# Altium schematic sheet SCH_RP2040_2022-08-20.schdoc
size 298 x 162 mm
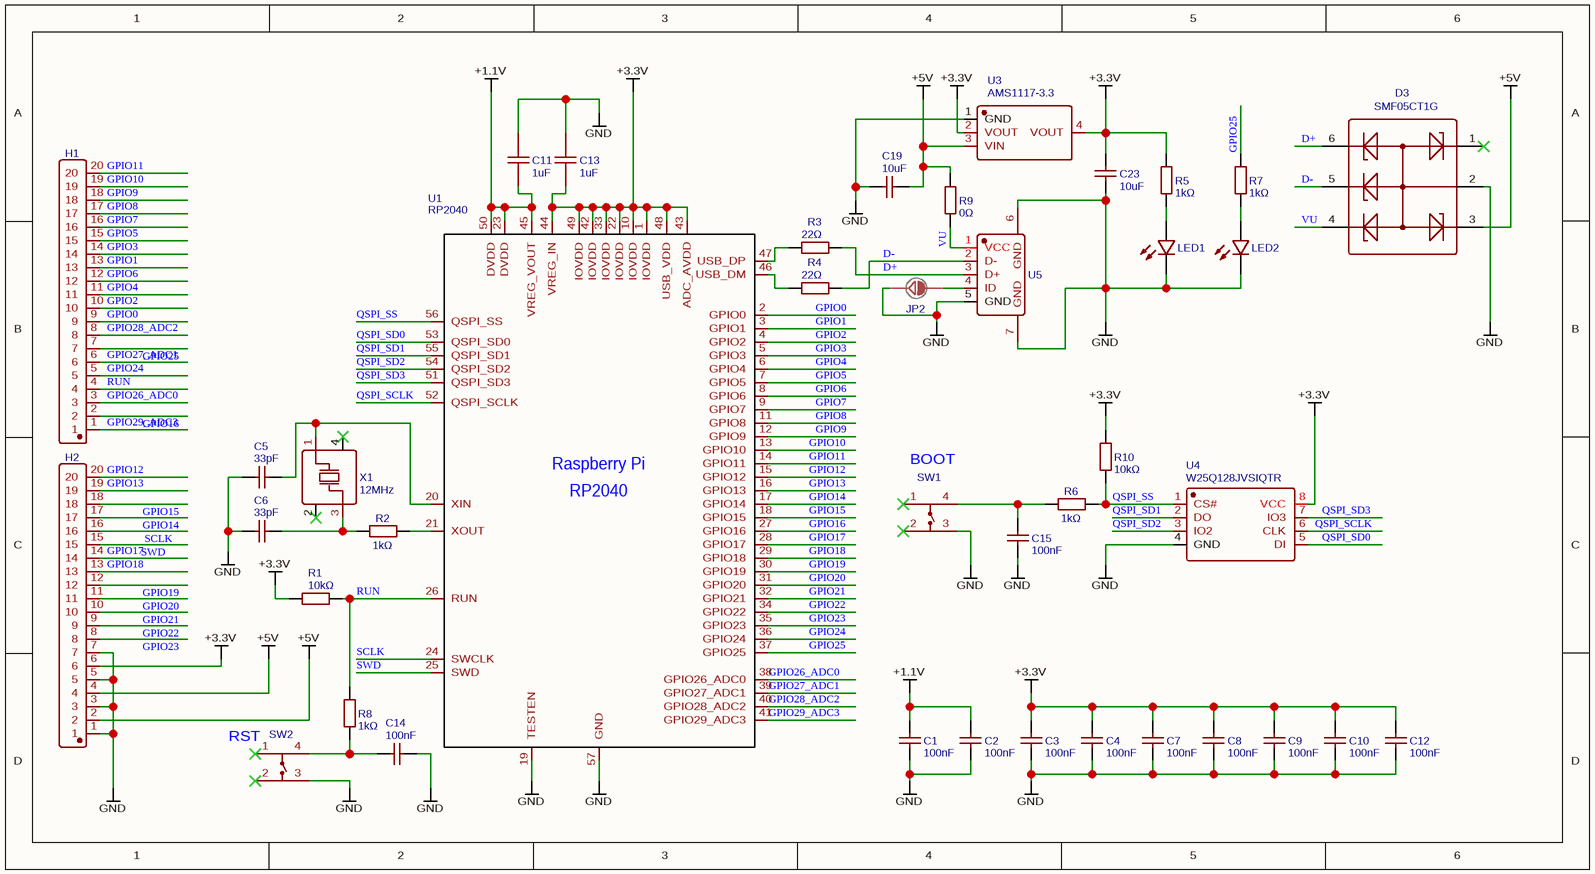
[diagram p0: SCH_RP2040_2022-08-20.schdoc]

## Parts
C1  100nF  [C0402_NEW]
C2  100nF  [C0402_NEW]
C3  100nF  [C0402_NEW]
C4  100nF  [C0402_NEW]
C5  33pF  [C0402]
C6  33pF  [C0402]
C7  100nF  [C0402_NEW]
C8  100nF  [C0402_NEW]
C9  100nF  [C0402_NEW]
C10  100nF  [C0402_NEW]
C11  1uF  [C0402]
C12  100nF  [C0402_NEW]
C13  1uF  [C0402]
C14  100nF  [C0402_NEW]
C15  100nF  [C0402_NEW]
C19  10uF  [C1206]
C23  10uF  [C1206]
D3  SMF05CT1G  [SOT-363_L2.0-W1.3-P0.65-LS2.1-TL]
H1  KH-2.54PH180-1X20P-L11.5  [HDR-TH_20P-P2.54-V-M]  (value not drawn)
H2  KH-2.54PH180-1X20P-L11.5  [HDR-TH_20P-P2.54-V-M]  (value not drawn)
JP2  JUMPER-SMT_2  [JUMPERS_SMT-JUMPER_2_NC_PASTE_NO-SILK]  (value not drawn)
LED1  19-217/BHC-ZL1M2RY/3T  [LED0603-R-RD_BLUE]  (value not drawn)
LED2  19-217/BHC-ZL1M2RY/3T  [LED0603-R-RD_BLUE]  (value not drawn)
R1  10kΩ  [R0402]
R2  1kΩ  [R0402]
R3  22Ω  [R0402]
R4  22Ω  [R0402]
R5  1kΩ  [R0402]
R6  1kΩ  [R0402]
R7  1kΩ  [R0402]
R8  1kΩ  [R0402]
R9  0Ω  [R0603]
R10  10kΩ  [R0402]
SW1  TD-1182SA-2.0H-250  [SW-SMD_4P-L3.5-W3.0-P1.50-LS4.6_DEALON_TD-1182SA-2.0H-250]  (value not drawn)
SW2  TD-1182SA-2.0H-250  [SW-SMD_4P-L3.5-W3.0-P1.50-LS4.6_DEALON_TD-1182SA-2.0H-250]  (value not drawn)
U1  RP2040  [LQFN-56_L7.0-W7.0-P0.4-EP]
U3  AMS1117-3.3  [SOT-223-3_L6.5-W3.4-P2.30-LS7.0-BR]
U4  W25Q128JVSIQTR  [SOIC-8_L5.3-W5.3-P1.27-LS8.0-BL]
U5  U253-051N-4BH89-S2S  [MICRO-USB-SMD_U253-051N-4BH89-S2S]  (value not drawn)
X1  12MHz  [OSC-SMD_4P-L3.2-W2.5-BL]

## Nets
+1.1V: C1.2 C2.2 C11.1 U1.23(DVDD) U1.45(VREG_VOUT) U1.50(DVDD)
+3.3V: C3.2 C4.2 C7.2 C8.2 C9.2 C10.2 C12.2 C13.1 C23.2 H2.6 R1.2 R5.2 R10.2 U1.1(IOVDD) U1.10(IOVDD) U1.22(IOVDD) U1.33(IOVDD) U1.42(IOVDD) U1.43(ADC_AVDD) U1.44(VREG_IN) U1.48(USB_VDD) U1.49(IOVDD) U3.2(VOUT) U3.4(VOUT) U4.8(VCC)
+5V: C19.2 D3.3 H2.2 H2.4 R9.2 U3.3(VIN)
GND: C1.1 C2.1 C3.1 C4.1 C5.1 C6.1 C7.1 C8.1 C9.1 C10.1 C11.2 C12.1 C13.2 C14.1 C15.1 C19.1 C23.1 D3.2 H2.1 H2.3 H2.5 H2.7 JP2.1 LED1.2(C) LED2.2(C) SW1.3 SW2.3 U1.19(TESTEN) U1.57(GND) U3.1(GND) U4.4(GND) U5.5(GND) U5.6(GND) U5.7(GND)
D+: D3.6 R3.1 U5.3(D+)
D-: D3.5 R4.1 U5.2(D-)
GPIO0: H1.9 U1.2(GPIO0)
GPIO1: H1.13 U1.3(GPIO1)
GPIO2: H1.10 U1.4(GPIO2)
GPIO3: H1.14 U1.5(GPIO3)
GPIO4: H1.11 U1.6(GPIO4)
GPIO5: H1.15 U1.7(GPIO5)
GPIO6: H1.12 U1.8(GPIO6)
GPIO7: H1.16 U1.9(GPIO7)
GPIO8: H1.17 U1.11(GPIO8)
GPIO9: H1.18 U1.12(GPIO9)
GPIO10: H1.19 U1.13(GPIO10)
GPIO11: H1.20 U1.14(GPIO11)
GPIO12: H2.20 U1.15(GPIO12)
GPIO13: H2.19 U1.16(GPIO13)
GPIO14: H2.17 U1.17(GPIO14)
GPIO15: H2.18 U1.18(GPIO15)
GPIO16: H1.2 U1.27(GPIO16)
GPIO17: H2.14 U1.28(GPIO17)
GPIO18: H2.13 U1.29(GPIO18)
GPIO19: H2.12 U1.30(GPIO19)
GPIO20: H2.11 U1.31(GPIO20)
GPIO21: H2.10 U1.32(GPIO21)
GPIO22: H2.9 U1.34(GPIO22)
GPIO23: H2.8 U1.35(GPIO23)
GPIO24: H1.5 U1.36(GPIO24)
GPIO25: H1.7 R7.2 U1.37(GPIO25)
GPIO26_ADC0: H1.3 U1.38(GPIO26_ADC0)
GPIO27_ADC1: H1.6 U1.39(GPIO27_ADC1)
GPIO28_ADC2: H1.8 U1.40(GPIO28_ADC2)
GPIO29_ADC3: H1.1 U1.41(GPIO29_ADC3)
QSPI_SCLK: U1.52(QSPI_SCLK) U4.6(CLK)
QSPI_SD0: U1.53(QSPI_SD0) U4.5(DI)
QSPI_SD1: U1.55(QSPI_SD1) U4.2(DO)
QSPI_SD2: U1.54(QSPI_SD2) U4.3(IO2)
QSPI_SD3: U1.51(QSPI_SD3) U4.7(IO3)
QSPI_SS: R6.2 R10.1 U1.56(QSPI_SS) U4.1(CS#)
RUN: H1.4 R1.1 R8.2 U1.26(RUN)
SCLK: H2.16 U1.24(SWCLK)
SWD: H2.15 U1.25(SWD)
VU: D3.4 R9.1 U5.1(VCC)
NetC5_2: C5.2 U1.20(XIN) X1.1(OSC1)
NetC6_2: C6.2 R2.1 X1.3(OSC2)
NetC14_2: C14.2 R8.1 SW2.4
NetC15_2: C15.2 R6.1 SW1.4
NetJP2_2: JP2.2 U5.4(ID)
NetLED1_1: LED1.1(A) R5.1
NetLED2_1: LED2.1(A) R7.1
NetR2_2: R2.2 U1.21(XOUT)
NetR3_2: R3.2 U1.47(USB_DP)
NetR4_2: R4.2 U1.46(USB_DM)

Not connected (* = marked no-connect by the designer): D3 1*; SW1 1* 2*; SW2 1* 2*; X1 2(GND)* 4(GND)*

## Notes on the sheet
- (near SW1) BOOT
- (near SW2) RST
- (in symbol RP2040) Raspberry Pi

## Library data of the parts
C1-C4 C7-C10 C12 C14 C15 = 100nF: BOM_Manufacturer Part: CL05B104KO5NNNC; BOM_Manufacturer: SAMSUNG; nameAlias: Capacitance; BOM_Supplier: LCSC; BOM_Supplier Part: C1525; BOM_JLCPCB Part Class: Basic Part; spicePre: C; spiceSymbolName: CL05B104KO5NNNC
C5 C6 = 33pF: BOM_Manufacturer: FH; BOM_Manufacturer Part: 0402CG330J500NT; nameAlias: Capacitance; BOM_Supplier: LCSC; BOM_Supplier Part: C1562; BOM_JLCPCB Part Class: Basic Part; spicePre: C; spiceSymbolName: 0402CG330J500NT
C11 C13 = 1uF: BOM_Manufacturer: SAMSUNG; BOM_Manufacturer Part: CL05A105KA5NQNC; nameAlias: Capacitance; BOM_Supplier: LCSC; BOM_Supplier Part: C52923; BOM_JLCPCB Part Class: Basic Part; spicePre: C; spiceSymbolName: CL05A105KA5NQNC
C19 C23 = 10uF: BOM_Manufacturer Part: CL31A106KBHNNNE; BOM_Manufacturer: SAMSUNG; nameAlias: Capacitance; BOM_Supplier: LCSC; BOM_Supplier Part: C13585; BOM_JLCPCB Part Class: Basic Part; spicePre: C; spiceSymbolName: CL31A106KBHNNNE
D3 = SMF05CT1G: BOM_Manufacturer: ON; BOM_Supplier: LCSC; BOM_Manufacturer Part: SMF05CT1G; BOM_Supplier Part: C15879; BOM_JLCPCB Part Class: Basic Part; spicePre: D; spiceSymbolName: SMF05CT1G
H1 H2 = KH-2.54PH180-1X20P-L11.5: BOM_Manufacturer: kinghelm(金航标); Contributor: LCSC; Package Display: No; BOM_Supplier: LCSC; BOM_Supplier Part: C2905493; BOM_Manufacturer Part: KH-2.54PH180-1X20P-L11.5; BOM_JLCPCB Part Class: Extended Part; spicePre: H; spiceSymbolName: KH-2.54PH180-1X20P-L11.5
JP2 = JUMPER-SMT_2: Contributor: Celeron; Package Display: No; spicePre: J; spiceSymbolName: JUMPER-SMT_2
LED1 LED2 = 19-217/BHC-ZL1M2RY/3T: BOM_Manufacturer: EVERLIGHT; Package Display: No; BOM_Supplier: LCSC; BOM_Manufacturer Part: 19-217/BHC-ZL1M2RY/3T; BOM_Supplier Part: C72041; BOM_JLCPCB Part Class: Basic Part; spicePre: L; spiceSymbolName: 19-217/BHC-ZL1M2RY/3T
R1 R10 = 10kΩ: BOM_Manufacturer: UniOhm; BOM_Manufacturer Part: 0402WGF1002TCE; nameAlias: Resistance; Resistance (Ohms): 10K; BOM_Supplier: LCSC; BOM_Supplier Part: C25744; BOM_JLCPCB Part Class: Basic Part; spicePre: R; spiceSymbolName: 0402WGF1002TCE
R2 R5-R8 = 1kΩ: BOM_Manufacturer: UniOhm; BOM_Manufacturer Part: 0402WGF1001TCE; nameAlias: Resistance; Resistance (Ohms): 1K; BOM_Supplier: LCSC; BOM_Supplier Part: C11702; BOM_JLCPCB Part Class: Basic Part; spicePre: R; spiceSymbolName: 0402WGF1001TCE
R3 R4 = 22Ω: BOM_Manufacturer: UniOhm; BOM_Manufacturer Part: 0402WGF220JTCE; nameAlias: Resistance; Resistance (Ohms): 22; BOM_Supplier: LCSC; BOM_Supplier Part: C25092; BOM_JLCPCB Part Class: Basic Part; spicePre: R; spiceSymbolName: 0402WGF220JTCE
R9 = 0Ω: BOM_Manufacturer: UniOhm; BOM_Manufacturer Part: 0603WAF0000T5E; nameAlias: Resistance; Resistance (Ohms): 0; BOM_Supplier: LCSC; BOM_Supplier Part: C21189; BOM_JLCPCB Part Class: Basic Part; spicePre: R; spiceSymbolName: 0603WAF0000T5E
SW1 SW2 = TD-1182SA-2.0H-250: BOM_Manufacturer: DEALON(德艺隆); Contributor: LCSC; Package Display: No; BOM_Supplier: LCSC; BOM_Supplier Part: C2905178; BOM_Manufacturer Part: TD-1182SA-2.0H-250; BOM_JLCPCB Part Class: Extended Part; spicePre: S; spiceSymbolName: TD-1182SA-2.0H-250
U1 = RP2040: BOM_Manufacturer: Raspberry Pi(树莓派); Contributor: LCSC; BOM_Supplier: LCSC; BOM_Supplier Part: C2040; BOM_Manufacturer Part: RP2040; BOM_JLCPCB Part Class: Extended Part; spicePre: U; spiceSymbolName: RP2040
U3 = AMS1117-3.3: BOM_Manufacturer: AMS; sourceId: dwIGgezVh; timeStamp: 1476261164; BOM_Supplier: LCSC; BOM_Manufacturer Part: AMS1117-3.3; BOM_Supplier Part: C6186; BOM_JLCPCB Part Class: Basic Part; spicePre: U; spiceSymbolName: AMS1117-3.3
U4 = W25Q128JVSIQTR: BOM_Manufacturer: WINBOND; BOM_Supplier: LCSC; BOM_Manufacturer Part: W25Q128JVSIQTR; BOM_Supplier Part: C97521; BOM_JLCPCB Part Class: Basic Part; spicePre: U; spiceSymbolName: W25Q128JVSIQTR
U5 = U253-051N-4BH89-S2S: BOM_Manufacturer: XKB Connectivity(中国星坤); Contributor: LCSC; Package Display: No; BOM_Supplier: LCSC; BOM_Supplier Part: C2880620; BOM_Manufacturer Part: U253-051N-4BH89-S2S; spicePre: U; spiceSymbolName: U253-051N-4BH89-S2S
X1 = 12MHz: BOM_Manufacturer: YXC; BOM_Manufacturer Part: X322512MSB4SI; nameAlias: Frequency; BOM_Supplier: LCSC; BOM_Supplier Part: C9002; BOM_JLCPCB Part Class: Basic Part; spicePre: X; spiceSymbolName: X322512MSB4SI